# Vivado block design proj_blk_design, xcu25-ffvc1760-2LV-e, Vivado 2020.1_AR75245
# (continued, part 2 of 3)
current_bd_instance /from_MAC10_is_MAC1

# ---- hierarchy /from_MAC01_is_MAC2 ----
current_bd_instance /from_MAC01_is_MAC2
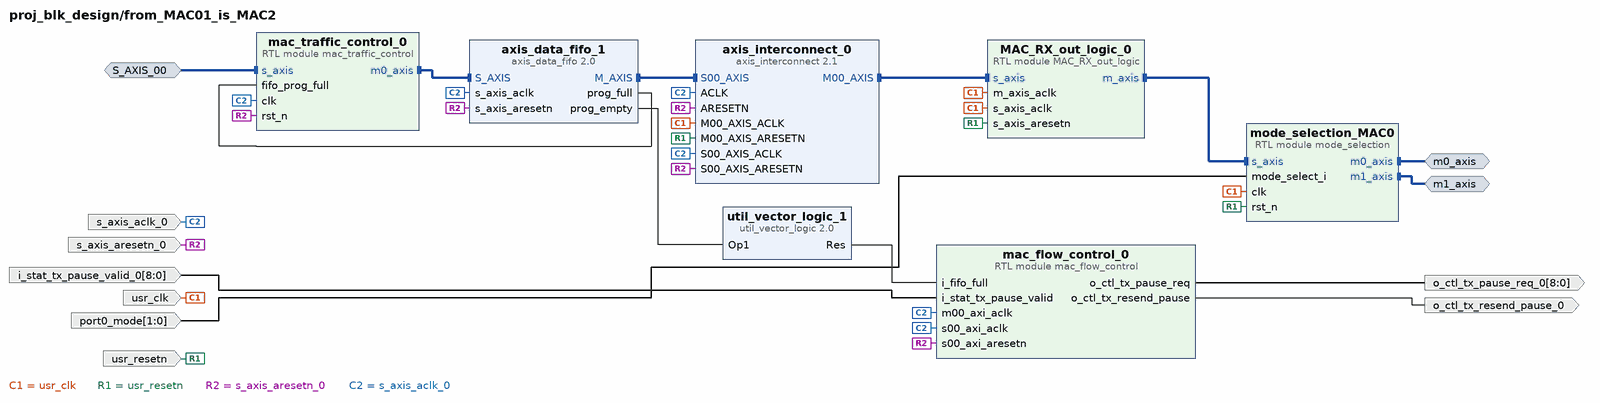
[diagram p10: block diagram inside /from_MAC01_is_MAC2]
create_bd_intf_pin -mode Slave -vlnv xilinx.com:interface:axis_rtl:1.0 S_AXIS_00
create_bd_intf_pin -mode Master -vlnv xilinx.com:interface:axis_rtl:1.0 m1_axis
create_bd_intf_pin -mode Master -vlnv xilinx.com:interface:axis_rtl:1.0 m0_axis
create_bd_pin -dir I -type clk usr_clk
create_bd_pin -dir I -type rst usr_resetn
create_bd_pin -dir I -from 8 -to 0 i_stat_tx_pause_valid_0
create_bd_pin -dir O -from 8 -to 0 o_ctl_tx_pause_req_0
create_bd_pin -dir O o_ctl_tx_resend_pause_0
create_bd_pin -dir I -type rst s_axis_aresetn_0
create_bd_pin -dir I -type clk s_axis_aclk_0
create_bd_pin -dir I -from 1 -to 0 port0_mode

create_bd_cell -type ip -vlnv xilinx.com:ip:axis_data_fifo:2.0 axis_data_fifo_1
set_property -dict [list \
  CONFIG.FIFO_DEPTH 1024 \
  CONFIG.FIFO_MODE 2 \
  CONFIG.HAS_PROG_EMPTY 1 \
  CONFIG.HAS_PROG_FULL 1 \
  CONFIG.HAS_TKEEP 1 \
  CONFIG.PROG_EMPTY_THRESH 300 \
  CONFIG.PROG_FULL_THRESH 800 \
  CONFIG.TDATA_NUM_BYTES 8 \
  CONFIG.TDEST_WIDTH 0 \
] [get_bd_cells axis_data_fifo_1]
create_bd_cell -type ip -vlnv xilinx.com:ip:util_vector_logic:2.0 util_vector_logic_1
set_property -dict {CONFIG.C_OPERATION not CONFIG.C_SIZE 1} [get_bd_cells util_vector_logic_1]
create_bd_cell -type ip -vlnv xilinx.com:ip:axis_interconnect:2.1 axis_interconnect_0
set_property -dict [list \
  CONFIG.ARB_ON_TLAST 1 \
  CONFIG.M00_AXIS_HIGHTDEST 0x00000003 \
  CONFIG.M00_FIFO_DEPTH 32 \
  CONFIG.M00_FIFO_MODE 0 \
  CONFIG.M00_HAS_REGSLICE 1 \
  CONFIG.NUM_MI 1 \
  CONFIG.S00_FIFO_DEPTH 256 \
  CONFIG.S00_FIFO_MODE 1 \
  CONFIG.S00_HAS_REGSLICE 1 \
] [get_bd_cells axis_interconnect_0]
create_bd_cell -type module -reference mac_traffic_control mac_traffic_control_0
create_bd_cell -type module -reference MAC_RX_out_logic MAC_RX_out_logic_0
set_property -dict {CONFIG.TDEST_VALUE {"10"}} [get_bd_cells MAC_RX_out_logic_0]
create_bd_cell -type module -reference mac_flow_control mac_flow_control_0
create_bd_cell -type module -reference mode_selection mode_selection_MAC0

# ---- hierarchy /from_MAC11_is_MAC3 ----
current_bd_instance /from_MAC11_is_MAC3
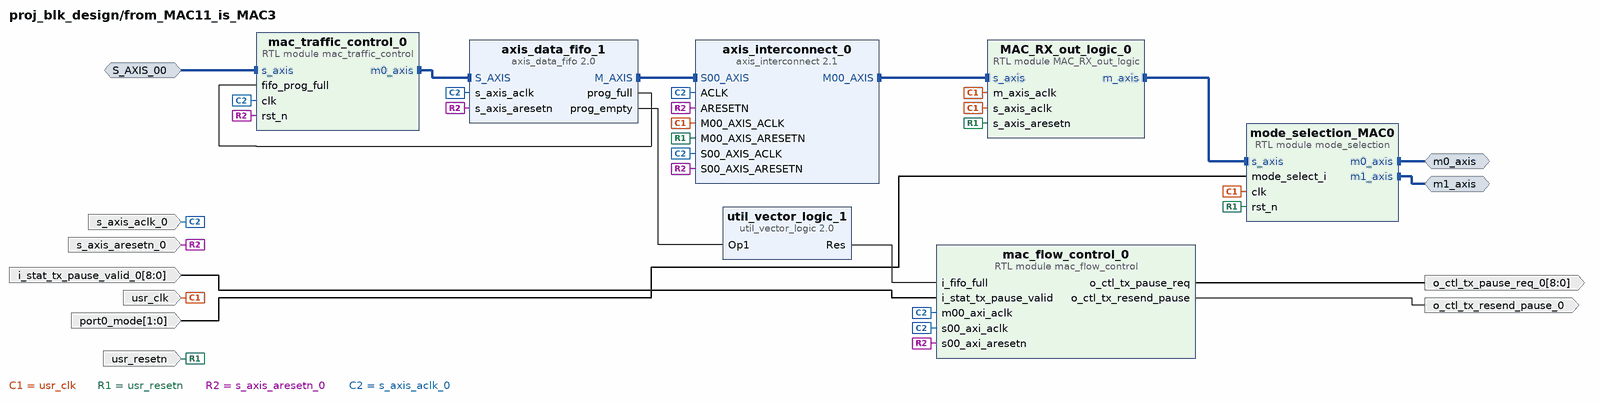
[diagram p11: block diagram inside /from_MAC11_is_MAC3]
create_bd_intf_pin -mode Slave -vlnv xilinx.com:interface:axis_rtl:1.0 S_AXIS_00
create_bd_intf_pin -mode Master -vlnv xilinx.com:interface:axis_rtl:1.0 m1_axis
create_bd_intf_pin -mode Master -vlnv xilinx.com:interface:axis_rtl:1.0 m0_axis
create_bd_pin -dir I -type clk usr_clk
create_bd_pin -dir I -type rst usr_resetn
create_bd_pin -dir I -from 8 -to 0 i_stat_tx_pause_valid_0
create_bd_pin -dir O -from 8 -to 0 o_ctl_tx_pause_req_0
create_bd_pin -dir O o_ctl_tx_resend_pause_0
create_bd_pin -dir I -type rst s_axis_aresetn_0
create_bd_pin -dir I -type clk s_axis_aclk_0
create_bd_pin -dir I -from 1 -to 0 port0_mode

create_bd_cell -type ip -vlnv xilinx.com:ip:axis_data_fifo:2.0 axis_data_fifo_1
set_property -dict [list \
  CONFIG.FIFO_DEPTH 1024 \
  CONFIG.FIFO_MODE 2 \
  CONFIG.HAS_PROG_EMPTY 1 \
  CONFIG.HAS_PROG_FULL 1 \
  CONFIG.HAS_TKEEP 1 \
  CONFIG.PROG_EMPTY_THRESH 300 \
  CONFIG.PROG_FULL_THRESH 800 \
  CONFIG.TDATA_NUM_BYTES 8 \
  CONFIG.TDEST_WIDTH 0 \
] [get_bd_cells axis_data_fifo_1]
create_bd_cell -type ip -vlnv xilinx.com:ip:util_vector_logic:2.0 util_vector_logic_1
set_property -dict {CONFIG.C_OPERATION not CONFIG.C_SIZE 1} [get_bd_cells util_vector_logic_1]
create_bd_cell -type ip -vlnv xilinx.com:ip:axis_interconnect:2.1 axis_interconnect_0
set_property -dict [list \
  CONFIG.ARB_ON_TLAST 1 \
  CONFIG.M00_AXIS_HIGHTDEST 0x00000003 \
  CONFIG.M00_FIFO_DEPTH 32 \
  CONFIG.M00_FIFO_MODE 0 \
  CONFIG.M00_HAS_REGSLICE 1 \
  CONFIG.NUM_MI 1 \
  CONFIG.S00_FIFO_DEPTH 256 \
  CONFIG.S00_FIFO_MODE 1 \
  CONFIG.S00_HAS_REGSLICE 1 \
] [get_bd_cells axis_interconnect_0]
create_bd_cell -type module -reference mac_traffic_control mac_traffic_control_0
create_bd_cell -type module -reference MAC_RX_out_logic MAC_RX_out_logic_0
set_property -dict {CONFIG.TDEST_VALUE {"11"}} [get_bd_cells MAC_RX_out_logic_0]
create_bd_cell -type module -reference mac_flow_control mac_flow_control_0
create_bd_cell -type module -reference mode_selection mode_selection_MAC0

# ---- connections ----

current_bd_instance /MCDI
connect_bd_intf_net [get_bd_intf_pins INTC_to_MCDI/M00_AXIS] [get_bd_intf_pins mcdi_check_0/s_axis]
connect_bd_intf_net [get_bd_intf_pins m1_axis] [get_bd_intf_pins demux_logic_MCDI_0/m1_axis]
connect_bd_intf_net [get_bd_intf_pins m0_axis_MCDI] [get_bd_intf_pins demux_logic_MCDI_0/m0_axis]
connect_bd_intf_net [get_bd_intf_pins S00_AXIS] [get_bd_intf_pins INTC_to_MCDI/S00_AXIS]
connect_bd_intf_net [get_bd_intf_pins S01_AXIS] [get_bd_intf_pins INTC_to_MCDI/S01_AXIS]
connect_bd_net -net aclk_1 [get_bd_pins clk_200M] \
  [get_bd_pins INTC_to_MCDI/ACLK] [get_bd_pins INTC_to_MCDI/M00_AXIS_ACLK] [get_bd_pins INTC_to_MCDI/S00_AXIS_ACLK] \
  [get_bd_pins INTC_to_MCDI/S01_AXIS_ACLK] [get_bd_pins axis_register_slice_0/aclk] \
  [get_bd_pins demux_logic_MCDI_0/m0_axis_aclk] [get_bd_pins demux_logic_MCDI_0/m1_axis_aclk] \
  [get_bd_pins demux_logic_MCDI_0/s_axis_aclk] [get_bd_pins mcdi_check_0/m_axis_aclk] [get_bd_pins mcdi_check_0/s_axis_aclk]
connect_bd_net [get_bd_pins axis_register_slice_0/m_axis_tdata] [get_bd_pins demux_logic_MCDI_0/s_axis_tdata]
connect_bd_net [get_bd_pins axis_register_slice_0/m_axis_tdest] [get_bd_pins demux_logic_MCDI_0/s_axis_tdest]
connect_bd_net [get_bd_pins axis_register_slice_0/m_axis_tkeep] [get_bd_pins demux_logic_MCDI_0/s_axis_tkeep]
connect_bd_net [get_bd_pins axis_register_slice_0/m_axis_tlast] [get_bd_pins demux_logic_MCDI_0/s_axis_tlast]
connect_bd_net [get_bd_pins axis_register_slice_0/m_axis_tuser] [get_bd_pins demux_logic_MCDI_0/demux_en]
connect_bd_net [get_bd_pins axis_register_slice_0/m_axis_tvalid] [get_bd_pins demux_logic_MCDI_0/s_axis_tvalid]
connect_bd_net [get_bd_pins axis_register_slice_0/s_axis_tready] [get_bd_pins mcdi_check_0/m_axis_tready]
connect_bd_net [get_bd_pins demux_logic_MCDI_0/s_axis_tready] [get_bd_pins axis_register_slice_0/m_axis_tready]
connect_bd_net [get_bd_pins mcdi_check_0/m_axis_tdata] [get_bd_pins axis_register_slice_0/s_axis_tdata]
connect_bd_net [get_bd_pins mcdi_check_0/m_axis_tdest] [get_bd_pins axis_register_slice_0/s_axis_tdest]
connect_bd_net [get_bd_pins mcdi_check_0/m_axis_tkeep] [get_bd_pins axis_register_slice_0/s_axis_tkeep]
connect_bd_net [get_bd_pins mcdi_check_0/m_axis_tlast] [get_bd_pins axis_register_slice_0/s_axis_tlast]
connect_bd_net [get_bd_pins mcdi_check_0/m_axis_tvalid] [get_bd_pins axis_register_slice_0/s_axis_tvalid]
connect_bd_net [get_bd_pins mcdi_check_0/mcdi_flag_o] [get_bd_pins axis_register_slice_0/s_axis_tuser]
connect_bd_net [get_bd_pins port0_mode] [get_bd_pins mcdi_check_0/mode_select_MAC2]
connect_bd_net [get_bd_pins port1_mode] [get_bd_pins mcdi_check_0/mode_select_MAC3]
connect_bd_net [get_bd_pins s_axi_aresetn] \
  [get_bd_pins INTC_to_MCDI/ARESETN] [get_bd_pins INTC_to_MCDI/M00_AXIS_ARESETN] [get_bd_pins INTC_to_MCDI/S00_AXIS_ARESETN] \
  [get_bd_pins INTC_to_MCDI/S01_AXIS_ARESETN] [get_bd_pins axis_register_slice_0/aresetn] \
  [get_bd_pins demux_logic_MCDI_0/s_axis_aresetn] [get_bd_pins mcdi_check_0/s_axis_aresetn]

current_bd_instance /PS
connect_bd_intf_net [get_bd_intf_pins S_AXIS] [get_bd_intf_pins axis_data_fifo_0/S_AXIS]
connect_bd_intf_net [get_bd_intf_pins axi_mcdma_0/M_AXI_MM2S] [get_bd_intf_pins smartconnect_0/S00_AXI]
connect_bd_intf_net [get_bd_intf_pins M_AXIS_MM2S] [get_bd_intf_pins axi_mcdma_0/M_AXIS_MM2S]
connect_bd_intf_net [get_bd_intf_pins S_AXI_LITE] [get_bd_intf_pins axi_mcdma_0/S_AXI_LITE]
connect_bd_intf_net [get_bd_intf_pins M_AXI_HPM0_LPD] [get_bd_intf_pins zynq_ultra_ps_e_0/M_AXI_HPM0_LPD]
connect_bd_intf_net [get_bd_intf_pins axi_mcdma_0/M_AXI_SG] [get_bd_intf_pins smartconnect_0/S02_AXI]
connect_bd_intf_net [get_bd_intf_pins axis_data_fifo_0/M_AXIS] [get_bd_intf_pins axi_mcdma_0/S_AXIS_S2MM]
connect_bd_intf_net [get_bd_intf_pins axi_mcdma_0/M_AXI_S2MM] [get_bd_intf_pins smartconnect_0/S01_AXI]
connect_bd_intf_net [get_bd_intf_pins smartconnect_0/M00_AXI] [get_bd_intf_pins zynq_ultra_ps_e_0/S_AXI_HP0_FPD]
connect_bd_net [get_bd_pins axi_mcdma_0/mm2s_ch1_introut] [get_bd_pins xlconcat_0/In0]
connect_bd_net [get_bd_pins axi_mcdma_0/mm2s_ch2_introut] [get_bd_pins xlconcat_0/In1]
connect_bd_net [get_bd_pins axi_mcdma_0/mm2s_ch3_introut] [get_bd_pins xlconcat_0/In2]
connect_bd_net [get_bd_pins axi_mcdma_0/mm2s_ch4_introut] [get_bd_pins xlconcat_0/In3]
connect_bd_net [get_bd_pins axi_mcdma_0/s2mm_ch1_introut] [get_bd_pins xlconcat_1/In0]
connect_bd_net [get_bd_pins axi_mcdma_0/s2mm_ch2_introut] [get_bd_pins xlconcat_1/In1]
connect_bd_net [get_bd_pins axi_mcdma_0/s2mm_ch3_introut] [get_bd_pins xlconcat_1/In2]
connect_bd_net [get_bd_pins axi_mcdma_0/s2mm_ch4_introut] [get_bd_pins xlconcat_1/In3]
connect_bd_net [get_bd_pins util_reduced_logic_0/Res] [get_bd_pins xlconcat_2/In0]
connect_bd_net [get_bd_pins util_reduced_logic_1/Res] [get_bd_pins xlconcat_2/In1]
connect_bd_net [get_bd_pins xlconcat_0/dout] [get_bd_pins util_reduced_logic_1/Op1]
connect_bd_net [get_bd_pins xlconcat_1/dout] [get_bd_pins util_reduced_logic_0/Op1]
connect_bd_net [get_bd_pins xlconcat_2/dout] [get_bd_pins zynq_ultra_ps_e_0/pl_ps_irq0]
connect_bd_net [get_bd_pins zynq_ultra_ps_e_0/pl_clk0] \
  [get_bd_pins pl_clk0] [get_bd_pins axi_mcdma_0/m_axi_mm2s_aclk] [get_bd_pins axi_mcdma_0/m_axi_s2mm_aclk] \
  [get_bd_pins axi_mcdma_0/m_axi_sg_aclk] [get_bd_pins axi_mcdma_0/s_axi_lite_aclk] \
  [get_bd_pins proc_sys_reset_0/slowest_sync_clk] [get_bd_pins smartconnect_0/aclk] \
  [get_bd_pins zynq_ultra_ps_e_0/maxihpm0_lpd_aclk] [get_bd_pins zynq_ultra_ps_e_0/saxihp0_fpd_aclk] \
  [get_bd_pins axis_data_fifo_0/m_axis_aclk]
connect_bd_net -net zynq_ultra_ps_e_0_pl_resetn0 [get_bd_pins proc_sys_reset_0/peripheral_aresetn] \
  [get_bd_pins peripheral_aresetn] [get_bd_pins axi_mcdma_0/axi_resetn] [get_bd_pins smartconnect_0/aresetn]
connect_bd_net [get_bd_pins zynq_ultra_ps_e_0/pl_resetn0] [get_bd_pins proc_sys_reset_0/ext_reset_in]
connect_bd_net [get_bd_pins S00_AXIS_ACLK] [get_bd_pins axis_data_fifo_0/s_axis_aclk]
connect_bd_net -net s_axis_aresetn_0_1 [get_bd_pins s_axis_aresetn_0] [get_bd_pins axis_data_fifo_0/s_axis_aresetn]

current_bd_instance /from_MAC00_is_MAC0
connect_bd_intf_net [get_bd_intf_pins mac_traffic_control_0/m0_axis] [get_bd_intf_pins axis_data_fifo_1/S_AXIS]
connect_bd_intf_net [get_bd_intf_pins axis_data_fifo_1/M_AXIS] [get_bd_intf_pins axis_interconnect_0/S00_AXIS]
connect_bd_intf_net [get_bd_intf_pins S_AXIS_00] [get_bd_intf_pins mac_traffic_control_0/s_axis]
connect_bd_intf_net [get_bd_intf_pins m1_axis] [get_bd_intf_pins mode_selection_MAC0/m1_axis]
connect_bd_intf_net [get_bd_intf_pins MAC_RX_out_logic_0/m_axis] [get_bd_intf_pins mode_selection_MAC0/s_axis]
connect_bd_intf_net [get_bd_intf_pins m0_axis] [get_bd_intf_pins mode_selection_MAC0/m0_axis]
connect_bd_intf_net [get_bd_intf_pins axis_interconnect_0/M00_AXIS] [get_bd_intf_pins MAC_RX_out_logic_0/s_axis]
connect_bd_net [get_bd_pins util_vector_logic_1/Res] [get_bd_pins mac_flow_control_0/i_fifo_full]
connect_bd_net [get_bd_pins axis_data_fifo_1/prog_full] [get_bd_pins mac_traffic_control_0/fifo_prog_full]
connect_bd_net [get_bd_pins axis_data_fifo_1/prog_empty] [get_bd_pins util_vector_logic_1/Op1]
connect_bd_net [get_bd_pins usr_clk] \
  [get_bd_pins axis_interconnect_0/M00_AXIS_ACLK] [get_bd_pins MAC_RX_out_logic_0/s_axis_aclk] \
  [get_bd_pins MAC_RX_out_logic_0/m_axis_aclk] [get_bd_pins mode_selection_MAC0/clk]
connect_bd_net [get_bd_pins usr_resetn] \
  [get_bd_pins axis_interconnect_0/M00_AXIS_ARESETN] [get_bd_pins MAC_RX_out_logic_0/s_axis_aresetn] \
  [get_bd_pins mode_selection_MAC0/rst_n]
connect_bd_net -net i_stat_tx_pause_valid_0_1 [get_bd_pins i_stat_tx_pause_valid_0] [get_bd_pins mac_flow_control_0/i_stat_tx_pause_valid]
connect_bd_net [get_bd_pins mac_flow_control_0/o_ctl_tx_pause_req] [get_bd_pins o_ctl_tx_pause_req_0]
connect_bd_net [get_bd_pins mac_flow_control_0/o_ctl_tx_resend_pause] [get_bd_pins o_ctl_tx_resend_pause_0]
connect_bd_net -net s_axis_aresetn_0_1 [get_bd_pins s_axis_aresetn_0] \
  [get_bd_pins axis_data_fifo_1/s_axis_aresetn] [get_bd_pins axis_interconnect_0/ARESETN] \
  [get_bd_pins axis_interconnect_0/S00_AXIS_ARESETN] [get_bd_pins mac_traffic_control_0/rst_n] \
  [get_bd_pins mac_flow_control_0/s00_axi_aresetn]
connect_bd_net -net s_axis_aclk_0_1 [get_bd_pins s_axis_aclk_0] \
  [get_bd_pins axis_interconnect_0/S00_AXIS_ACLK] [get_bd_pins axis_interconnect_0/ACLK] \
  [get_bd_pins axis_data_fifo_1/s_axis_aclk] [get_bd_pins mac_traffic_control_0/clk] \
  [get_bd_pins mac_flow_control_0/s00_axi_aclk] [get_bd_pins mac_flow_control_0/m00_axi_aclk]
connect_bd_net [get_bd_pins port0_mode] [get_bd_pins mode_selection_MAC0/mode_select_i]

current_bd_instance /from_ps
connect_bd_intf_net [get_bd_intf_pins Control_VLAN_PUSH_0/m_axis] [get_bd_intf_pins demux_logic_0/s_axis]
connect_bd_intf_net [get_bd_intf_pins S_AXIS] [get_bd_intf_pins fifo_PS_to_Cntrl_VLAN/S_AXIS]
connect_bd_intf_net [get_bd_intf_pins M_AXIS1] [get_bd_intf_pins fifo_CNTRL_VLAN_to_MAC2/M_AXIS]
connect_bd_intf_net [get_bd_intf_pins M_AXIS] [get_bd_intf_pins fifo_CNTRL_VLAN_to_MAC3/M_AXIS]
connect_bd_net [get_bd_pins Control_VLAN_PUSH_0/egress_flag] [get_bd_pins demux_logic_0/demux_en]
connect_bd_net [get_bd_pins demux_logic_0/m0_axis_tvalid] [get_bd_pins fifo_CNTRL_VLAN_to_MAC2/s_axis_tvalid]
connect_bd_net [get_bd_pins fifo_CNTRL_VLAN_to_MAC2/s_axis_tready] [get_bd_pins demux_logic_0/m0_axis_tready]
connect_bd_net [get_bd_pins demux_logic_0/m0_axis_tlast] [get_bd_pins fifo_CNTRL_VLAN_to_MAC2/s_axis_tlast]
connect_bd_net [get_bd_pins demux_logic_0/m0_axis_tdata] [get_bd_pins fifo_CNTRL_VLAN_to_MAC2/s_axis_tdata]
connect_bd_net [get_bd_pins demux_logic_0/m0_axis_tkeep] [get_bd_pins fifo_CNTRL_VLAN_to_MAC2/s_axis_tkeep]
connect_bd_net [get_bd_pins demux_logic_0/m1_axis_tvalid] [get_bd_pins fifo_CNTRL_VLAN_to_MAC3/s_axis_tvalid]
connect_bd_net [get_bd_pins fifo_CNTRL_VLAN_to_MAC3/s_axis_tready] [get_bd_pins demux_logic_0/m1_axis_tready]
connect_bd_net [get_bd_pins demux_logic_0/m1_axis_tlast] [get_bd_pins fifo_CNTRL_VLAN_to_MAC3/s_axis_tlast]
connect_bd_net [get_bd_pins demux_logic_0/m1_axis_tdata] [get_bd_pins fifo_CNTRL_VLAN_to_MAC3/s_axis_tdata]
connect_bd_net [get_bd_pins demux_logic_0/m1_axis_tkeep] [get_bd_pins fifo_CNTRL_VLAN_to_MAC3/s_axis_tkeep]
connect_bd_net [get_bd_pins fifo_PS_to_Cntrl_VLAN/m_axis_tvalid] [get_bd_pins Control_VLAN_PUSH_0/s_axis_tvalid]
connect_bd_net [get_bd_pins Control_VLAN_PUSH_0/s_axis_tready] [get_bd_pins fifo_PS_to_Cntrl_VLAN/m_axis_tready]
connect_bd_net [get_bd_pins fifo_PS_to_Cntrl_VLAN/m_axis_tdata] [get_bd_pins Control_VLAN_PUSH_0/s_axis_tdata]
connect_bd_net [get_bd_pins fifo_PS_to_Cntrl_VLAN/m_axis_tkeep] [get_bd_pins Control_VLAN_PUSH_0/s_axis_tkeep]
connect_bd_net [get_bd_pins fifo_PS_to_Cntrl_VLAN/m_axis_tlast] [get_bd_pins Control_VLAN_PUSH_0/s_axis_tlast]
connect_bd_net [get_bd_pins fifo_PS_to_Cntrl_VLAN/m_axis_tdest] [get_bd_pins Control_VLAN_PUSH_0/s_axis_tdest]
connect_bd_net -net clk_wiz_0_clk_out2 [get_bd_pins m1_axis_aclk] \
  [get_bd_pins demux_logic_0/m1_axis_aclk] [get_bd_pins demux_logic_0/m0_axis_aclk] \
  [get_bd_pins Control_VLAN_PUSH_0/m_axis_aclk] [get_bd_pins Control_VLAN_PUSH_0/s_axis_aclk] \
  [get_bd_pins fifo_CNTRL_VLAN_to_MAC3/s_axis_aclk] [get_bd_pins fifo_CNTRL_VLAN_to_MAC2/s_axis_aclk] \
  [get_bd_pins fifo_PS_to_Cntrl_VLAN/m_axis_aclk] [get_bd_pins demux_logic_0/s_axis_aclk]
connect_bd_net -net clk_wiz_0_locked1 [get_bd_pins s_axis_aresetn] \
  [get_bd_pins fifo_PS_to_Cntrl_VLAN/s_axis_aresetn] [get_bd_pins Control_VLAN_PUSH_0/s_axis_aresetn] \
  [get_bd_pins fifo_CNTRL_VLAN_to_MAC3/s_axis_aresetn] [get_bd_pins fifo_CNTRL_VLAN_to_MAC2/s_axis_aresetn] \
  [get_bd_pins demux_logic_0/s_axis_aresetn]
connect_bd_net -net qdma_axi_aclk [get_bd_pins s_axis_aclk] [get_bd_pins fifo_PS_to_Cntrl_VLAN/s_axis_aclk]

current_bd_instance /to_MAC00_is_MAC0
connect_bd_intf_net [get_bd_intf_pins axis_interconnect_0/M00_AXIS] [get_bd_intf_pins tx_flow_control_0/s_axis]
connect_bd_intf_net [get_bd_intf_pins S00_AXIS] [get_bd_intf_pins axis_interconnect_0/S00_AXIS]
connect_bd_intf_net [get_bd_intf_pins m_axis_01] [get_bd_intf_pins tx_flow_control_0/m_axis]
connect_bd_intf_net [get_bd_intf_pins S01_AXIS] [get_bd_intf_pins axis_interconnect_0/S01_AXIS]
connect_bd_net [get_bd_pins util_vector_logic_1/Res] [get_bd_pins tx_flow_control_0/tready_frm_flow_cntrl]
connect_bd_net [get_bd_pins xlslice_0/Dout] [get_bd_pins util_vector_logic_1/Op1]
connect_bd_net -net M00_AXIS_ARESETN_0_1 [get_bd_pins s_axis_aresetn] \
  [get_bd_pins axis_interconnect_0/M00_AXIS_ARESETN] [get_bd_pins tx_flow_control_0/s_axis_aresetn]
connect_bd_net -net M00_AXIS_ACLK_0_1 [get_bd_pins tx_clk_01] \
  [get_bd_pins axis_interconnect_0/M00_AXIS_ACLK] [get_bd_pins tx_flow_control_0/m_axis_aclk] \
  [get_bd_pins tx_flow_control_0/s_axis_aclk]
connect_bd_net -net Din_0_1 [get_bd_pins stat_rx_pause_req_01_i] [get_bd_pins xlslice_0/Din]
connect_bd_net [get_bd_pins usr_clk] \
  [get_bd_pins axis_interconnect_0/S00_AXIS_ACLK] [get_bd_pins axis_interconnect_0/ACLK] \
  [get_bd_pins axis_interconnect_0/S01_AXIS_ACLK]
connect_bd_net [get_bd_pins user_aresetn] \
  [get_bd_pins axis_interconnect_0/S00_AXIS_ARESETN] [get_bd_pins axis_interconnect_0/ARESETN] \
  [get_bd_pins axis_interconnect_0/S01_AXIS_ARESETN]

current_bd_instance /to_MAC01_is_MAC2
connect_bd_intf_net [get_bd_intf_pins axis_interconnect_0/M00_AXIS] [get_bd_intf_pins tx_flow_control_0/s_axis]
connect_bd_intf_net [get_bd_intf_pins S01_AXIS] [get_bd_intf_pins axis_interconnect_0/S01_AXIS]
connect_bd_intf_net [get_bd_intf_pins S02_AXIS] [get_bd_intf_pins axis_interconnect_0/S02_AXIS]
connect_bd_intf_net [get_bd_intf_pins S00_AXIS] [get_bd_intf_pins axis_interconnect_0/S00_AXIS]
connect_bd_intf_net [get_bd_intf_pins m_axis_01] [get_bd_intf_pins tx_flow_control_0/m_axis]
connect_bd_net [get_bd_pins util_vector_logic_1/Res] [get_bd_pins tx_flow_control_0/tready_frm_flow_cntrl]
connect_bd_net [get_bd_pins xlslice_0/Dout] [get_bd_pins util_vector_logic_1/Op1]
connect_bd_net -net M00_AXIS_ARESETN_0_1 [get_bd_pins s_axis_aresetn] \
  [get_bd_pins axis_interconnect_0/M00_AXIS_ARESETN] [get_bd_pins tx_flow_control_0/s_axis_aresetn]
connect_bd_net -net M00_AXIS_ACLK_0_1 [get_bd_pins tx_clk_01] \
  [get_bd_pins axis_interconnect_0/M00_AXIS_ACLK] [get_bd_pins tx_flow_control_0/m_axis_aclk] \
  [get_bd_pins tx_flow_control_0/s_axis_aclk]
connect_bd_net -net Din_0_1 [get_bd_pins stat_rx_pause_req_01_i] [get_bd_pins xlslice_0/Din]
connect_bd_net [get_bd_pins usr_clk] \
  [get_bd_pins axis_interconnect_0/S00_AXIS_ACLK] [get_bd_pins axis_interconnect_0/ACLK] \
  [get_bd_pins axis_interconnect_0/S01_AXIS_ACLK] [get_bd_pins axis_interconnect_0/S02_AXIS_ACLK]
connect_bd_net [get_bd_pins user_aresetn] \
  [get_bd_pins axis_interconnect_0/S00_AXIS_ARESETN] [get_bd_pins axis_interconnect_0/ARESETN] \
  [get_bd_pins axis_interconnect_0/S01_AXIS_ARESETN] [get_bd_pins axis_interconnect_0/S02_AXIS_ARESETN]

current_bd_instance /to_MAC11_is_MAC3
connect_bd_intf_net [get_bd_intf_pins axis_interconnect_0/M00_AXIS] [get_bd_intf_pins tx_flow_control_0/s_axis]
connect_bd_intf_net [get_bd_intf_pins S01_AXIS] [get_bd_intf_pins axis_interconnect_0/S01_AXIS]
connect_bd_intf_net [get_bd_intf_pins m_axis_01] [get_bd_intf_pins tx_flow_control_0/m_axis]
connect_bd_intf_net [get_bd_intf_pins S00_AXIS] [get_bd_intf_pins axis_interconnect_0/S00_AXIS]
connect_bd_intf_net [get_bd_intf_pins S02_AXIS] [get_bd_intf_pins axis_interconnect_0/S02_AXIS]
connect_bd_net [get_bd_pins util_vector_logic_1/Res] [get_bd_pins tx_flow_control_0/tready_frm_flow_cntrl]
connect_bd_net [get_bd_pins xlslice_0/Dout] [get_bd_pins util_vector_logic_1/Op1]
connect_bd_net -net M00_AXIS_ARESETN_0_1 [get_bd_pins s_axis_aresetn] \
  [get_bd_pins axis_interconnect_0/M00_AXIS_ARESETN] [get_bd_pins tx_flow_control_0/s_axis_aresetn]
connect_bd_net -net M00_AXIS_ACLK_0_1 [get_bd_pins tx_clk_11] \
  [get_bd_pins axis_interconnect_0/M00_AXIS_ACLK] [get_bd_pins tx_flow_control_0/m_axis_aclk] \
  [get_bd_pins tx_flow_control_0/s_axis_aclk]
connect_bd_net -net Din_0_1 [get_bd_pins stat_rx_pause_req_11_i] [get_bd_pins xlslice_0/Din]
connect_bd_net [get_bd_pins usr_clk] \
  [get_bd_pins axis_interconnect_0/S00_AXIS_ACLK] [get_bd_pins axis_interconnect_0/ACLK] \
  [get_bd_pins axis_interconnect_0/S01_AXIS_ACLK] [get_bd_pins axis_interconnect_0/S02_AXIS_ACLK]
connect_bd_net [get_bd_pins user_aresetn] \
  [get_bd_pins axis_interconnect_0/S00_AXIS_ARESETN] [get_bd_pins axis_interconnect_0/ARESETN] \
  [get_bd_pins axis_interconnect_0/S01_AXIS_ARESETN] [get_bd_pins axis_interconnect_0/S02_AXIS_ARESETN]

current_bd_instance /to_MAC10_is_MAC1
connect_bd_intf_net [get_bd_intf_pins S00_AXIS] [get_bd_intf_pins axis_interconnect_0/S00_AXIS]
connect_bd_intf_net [get_bd_intf_pins axis_interconnect_0/M00_AXIS] [get_bd_intf_pins tx_flow_control_0/s_axis]
connect_bd_intf_net [get_bd_intf_pins m_axis_01] [get_bd_intf_pins tx_flow_control_0/m_axis]
connect_bd_intf_net [get_bd_intf_pins S01_AXIS] [get_bd_intf_pins axis_interconnect_0/S01_AXIS]
connect_bd_net [get_bd_pins util_vector_logic_1/Res] [get_bd_pins tx_flow_control_0/tready_frm_flow_cntrl]
connect_bd_net [get_bd_pins xlslice_0/Dout] [get_bd_pins util_vector_logic_1/Op1]
connect_bd_net -net M00_AXIS_ARESETN_0_1 [get_bd_pins s_axis_aresetn] \
  [get_bd_pins axis_interconnect_0/M00_AXIS_ARESETN] [get_bd_pins tx_flow_control_0/s_axis_aresetn]
connect_bd_net -net M00_AXIS_ACLK_0_1 [get_bd_pins tx_clk_01] \
  [get_bd_pins axis_interconnect_0/M00_AXIS_ACLK] [get_bd_pins tx_flow_control_0/m_axis_aclk] \
  [get_bd_pins tx_flow_control_0/s_axis_aclk]
connect_bd_net -net Din_0_1 [get_bd_pins stat_rx_pause_req_01_i] [get_bd_pins xlslice_0/Din]
connect_bd_net [get_bd_pins usr_clk] \
  [get_bd_pins axis_interconnect_0/S00_AXIS_ACLK] [get_bd_pins axis_interconnect_0/ACLK] \
  [get_bd_pins axis_interconnect_0/S01_AXIS_ACLK]
connect_bd_net [get_bd_pins user_aresetn] \
  [get_bd_pins axis_interconnect_0/S00_AXIS_ARESETN] [get_bd_pins axis_interconnect_0/ARESETN] \
  [get_bd_pins axis_interconnect_0/S01_AXIS_ARESETN]

current_bd_instance /from_MAC10_is_MAC1
connect_bd_intf_net [get_bd_intf_pins m0_axis] [get_bd_intf_pins mode_selection_MAC0/m0_axis]
connect_bd_intf_net [get_bd_intf_pins S_AXIS_00] [get_bd_intf_pins mac_traffic_control_0/s_axis]
connect_bd_intf_net [get_bd_intf_pins mac_traffic_control_0/m0_axis] [get_bd_intf_pins axis_data_fifo_1/S_AXIS]
connect_bd_intf_net [get_bd_intf_pins axis_data_fifo_1/M_AXIS] [get_bd_intf_pins axis_interconnect_0/S00_AXIS]
connect_bd_intf_net [get_bd_intf_pins m1_axis] [get_bd_intf_pins mode_selection_MAC0/m1_axis]
connect_bd_intf_net [get_bd_intf_pins MAC_RX_out_logic_0/m_axis] [get_bd_intf_pins mode_selection_MAC0/s_axis]
connect_bd_intf_net [get_bd_intf_pins axis_interconnect_0/M00_AXIS] [get_bd_intf_pins MAC_RX_out_logic_0/s_axis]
connect_bd_net [get_bd_pins util_vector_logic_1/Res] [get_bd_pins mac_flow_control_0/i_fifo_full]
connect_bd_net [get_bd_pins axis_data_fifo_1/prog_full] [get_bd_pins mac_traffic_control_0/fifo_prog_full]
connect_bd_net [get_bd_pins axis_data_fifo_1/prog_empty] [get_bd_pins util_vector_logic_1/Op1]
connect_bd_net [get_bd_pins usr_clk] \
  [get_bd_pins axis_interconnect_0/M00_AXIS_ACLK] [get_bd_pins MAC_RX_out_logic_0/s_axis_aclk] \
  [get_bd_pins MAC_RX_out_logic_0/m_axis_aclk] [get_bd_pins mode_selection_MAC0/clk]
connect_bd_net [get_bd_pins usr_resetn] \
  [get_bd_pins axis_interconnect_0/M00_AXIS_ARESETN] [get_bd_pins MAC_RX_out_logic_0/s_axis_aresetn] \
  [get_bd_pins mode_selection_MAC0/rst_n]
connect_bd_net -net i_stat_tx_pause_valid_0_1 [get_bd_pins i_stat_tx_pause_valid_0] [get_bd_pins mac_flow_control_0/i_stat_tx_pause_valid]
connect_bd_net [get_bd_pins mac_flow_control_0/o_ctl_tx_pause_req] [get_bd_pins o_ctl_tx_pause_req_0]
connect_bd_net [get_bd_pins mac_flow_control_0/o_ctl_tx_resend_pause] [get_bd_pins o_ctl_tx_resend_pause_0]
connect_bd_net -net s_axis_aresetn_0_1 [get_bd_pins s_axis_aresetn_0] \
  [get_bd_pins axis_data_fifo_1/s_axis_aresetn] [get_bd_pins axis_interconnect_0/ARESETN] \
  [get_bd_pins axis_interconnect_0/S00_AXIS_ARESETN] [get_bd_pins mac_traffic_control_0/rst_n] \
  [get_bd_pins mac_flow_control_0/s00_axi_aresetn]
connect_bd_net -net s_axis_aclk_0_1 [get_bd_pins s_axis_aclk_0] \
  [get_bd_pins axis_interconnect_0/S00_AXIS_ACLK] [get_bd_pins axis_interconnect_0/ACLK] \
  [get_bd_pins axis_data_fifo_1/s_axis_aclk] [get_bd_pins mac_traffic_control_0/clk] \
  [get_bd_pins mac_flow_control_0/s00_axi_aclk] [get_bd_pins mac_flow_control_0/m00_axi_aclk]
connect_bd_net [get_bd_pins port0_mode] [get_bd_pins mode_selection_MAC0/mode_select_i]

current_bd_instance /from_MAC01_is_MAC2
connect_bd_intf_net [get_bd_intf_pins m1_axis] [get_bd_intf_pins mode_selection_MAC0/m1_axis]
connect_bd_intf_net [get_bd_intf_pins axis_interconnect_0/M00_AXIS] [get_bd_intf_pins MAC_RX_out_logic_0/s_axis]
connect_bd_intf_net [get_bd_intf_pins MAC_RX_out_logic_0/m_axis] [get_bd_intf_pins mode_selection_MAC0/s_axis]
connect_bd_intf_net [get_bd_intf_pins m0_axis] [get_bd_intf_pins mode_selection_MAC0/m0_axis]
connect_bd_intf_net [get_bd_intf_pins S_AXIS_00] [get_bd_intf_pins mac_traffic_control_0/s_axis]
connect_bd_intf_net [get_bd_intf_pins axis_data_fifo_1/M_AXIS] [get_bd_intf_pins axis_interconnect_0/S00_AXIS]
connect_bd_intf_net [get_bd_intf_pins mac_traffic_control_0/m0_axis] [get_bd_intf_pins axis_data_fifo_1/S_AXIS]
connect_bd_net [get_bd_pins util_vector_logic_1/Res] [get_bd_pins mac_flow_control_0/i_fifo_full]
connect_bd_net [get_bd_pins axis_data_fifo_1/prog_full] [get_bd_pins mac_traffic_control_0/fifo_prog_full]
connect_bd_net [get_bd_pins axis_data_fifo_1/prog_empty] [get_bd_pins util_vector_logic_1/Op1]
connect_bd_net [get_bd_pins usr_clk] \
  [get_bd_pins axis_interconnect_0/M00_AXIS_ACLK] [get_bd_pins MAC_RX_out_logic_0/s_axis_aclk] \
  [get_bd_pins MAC_RX_out_logic_0/m_axis_aclk] [get_bd_pins mode_selection_MAC0/clk]
connect_bd_net [get_bd_pins usr_resetn] \
  [get_bd_pins axis_interconnect_0/M00_AXIS_ARESETN] [get_bd_pins MAC_RX_out_logic_0/s_axis_aresetn] \
  [get_bd_pins mode_selection_MAC0/rst_n]
connect_bd_net -net i_stat_tx_pause_valid_0_1 [get_bd_pins i_stat_tx_pause_valid_0] [get_bd_pins mac_flow_control_0/i_stat_tx_pause_valid]
connect_bd_net [get_bd_pins mac_flow_control_0/o_ctl_tx_pause_req] [get_bd_pins o_ctl_tx_pause_req_0]
connect_bd_net [get_bd_pins mac_flow_control_0/o_ctl_tx_resend_pause] [get_bd_pins o_ctl_tx_resend_pause_0]
connect_bd_net -net s_axis_aresetn_0_1 [get_bd_pins s_axis_aresetn_0] \
  [get_bd_pins axis_data_fifo_1/s_axis_aresetn] [get_bd_pins axis_interconnect_0/ARESETN] \
  [get_bd_pins axis_interconnect_0/S00_AXIS_ARESETN] [get_bd_pins mac_traffic_control_0/rst_n] \
  [get_bd_pins mac_flow_control_0/s00_axi_aresetn]
connect_bd_net -net s_axis_aclk_0_1 [get_bd_pins s_axis_aclk_0] \
  [get_bd_pins axis_interconnect_0/S00_AXIS_ACLK] [get_bd_pins axis_interconnect_0/ACLK] \
  [get_bd_pins axis_data_fifo_1/s_axis_aclk] [get_bd_pins mac_traffic_control_0/clk] \
  [get_bd_pins mac_flow_control_0/s00_axi_aclk] [get_bd_pins mac_flow_control_0/m00_axi_aclk]
connect_bd_net [get_bd_pins port0_mode] [get_bd_pins mode_selection_MAC0/mode_select_i]

current_bd_instance /from_MAC11_is_MAC3
connect_bd_intf_net [get_bd_intf_pins axis_data_fifo_1/M_AXIS] [get_bd_intf_pins axis_interconnect_0/S00_AXIS]
connect_bd_intf_net [get_bd_intf_pins mac_traffic_control_0/m0_axis] [get_bd_intf_pins axis_data_fifo_1/S_AXIS]
connect_bd_intf_net [get_bd_intf_pins MAC_RX_out_logic_0/m_axis] [get_bd_intf_pins mode_selection_MAC0/s_axis]
connect_bd_intf_net [get_bd_intf_pins axis_interconnect_0/M00_AXIS] [get_bd_intf_pins MAC_RX_out_logic_0/s_axis]
connect_bd_intf_net [get_bd_intf_pins m1_axis] [get_bd_intf_pins mode_selection_MAC0/m1_axis]
connect_bd_intf_net [get_bd_intf_pins m0_axis] [get_bd_intf_pins mode_selection_MAC0/m0_axis]
connect_bd_intf_net [get_bd_intf_pins S_AXIS_00] [get_bd_intf_pins mac_traffic_control_0/s_axis]
connect_bd_net [get_bd_pins util_vector_logic_1/Res] [get_bd_pins mac_flow_control_0/i_fifo_full]
connect_bd_net [get_bd_pins axis_data_fifo_1/prog_full] [get_bd_pins mac_traffic_control_0/fifo_prog_full]
connect_bd_net [get_bd_pins axis_data_fifo_1/prog_empty] [get_bd_pins util_vector_logic_1/Op1]
connect_bd_net [get_bd_pins usr_clk] \
  [get_bd_pins axis_interconnect_0/M00_AXIS_ACLK] [get_bd_pins MAC_RX_out_logic_0/s_axis_aclk] \
  [get_bd_pins MAC_RX_out_logic_0/m_axis_aclk] [get_bd_pins mode_selection_MAC0/clk]
connect_bd_net [get_bd_pins usr_resetn] \
  [get_bd_pins axis_interconnect_0/M00_AXIS_ARESETN] [get_bd_pins MAC_RX_out_logic_0/s_axis_aresetn] \
  [get_bd_pins mode_selection_MAC0/rst_n]
connect_bd_net -net i_stat_tx_pause_valid_0_1 [get_bd_pins i_stat_tx_pause_valid_0] [get_bd_pins mac_flow_control_0/i_stat_tx_pause_valid]
connect_bd_net [get_bd_pins mac_flow_control_0/o_ctl_tx_pause_req] [get_bd_pins o_ctl_tx_pause_req_0]
connect_bd_net [get_bd_pins mac_flow_control_0/o_ctl_tx_resend_pause] [get_bd_pins o_ctl_tx_resend_pause_0]
connect_bd_net -net s_axis_aresetn_0_1 [get_bd_pins s_axis_aresetn_0] \
  [get_bd_pins axis_data_fifo_1/s_axis_aresetn] [get_bd_pins axis_interconnect_0/ARESETN] \
  [get_bd_pins axis_interconnect_0/S00_AXIS_ARESETN] [get_bd_pins mac_traffic_control_0/rst_n] \
  [get_bd_pins mac_flow_control_0/s00_axi_aresetn]
connect_bd_net -net s_axis_aclk_0_1 [get_bd_pins s_axis_aclk_0] \
  [get_bd_pins axis_interconnect_0/S00_AXIS_ACLK] [get_bd_pins axis_interconnect_0/ACLK] \
  [get_bd_pins axis_data_fifo_1/s_axis_aclk] [get_bd_pins mac_traffic_control_0/clk] \
  [get_bd_pins mac_flow_control_0/s00_axi_aclk] [get_bd_pins mac_flow_control_0/m00_axi_aclk]
connect_bd_net [get_bd_pins port0_mode] [get_bd_pins mode_selection_MAC0/mode_select_i]

current_bd_instance /
connect_bd_intf_net [get_bd_intf_ports M01_AXIS] [get_bd_intf_pins dfx_decoupler_2/rp_intf_1]
connect_bd_intf_net [get_bd_intf_pins axi_interconnect_1/M06_AXI] [get_bd_intf_pins axi_gpio_3/S_AXI]
connect_bd_intf_net [get_bd_intf_pins from_MAC01_is_MAC2/m1_axis] [get_bd_intf_pins MCDI/S00_AXIS]
connect_bd_intf_net [get_bd_intf_pins from_MAC10_is_MAC1/m1_axis] [get_bd_intf_pins dfx_decoupler_0/rp_intf_1]
connect_bd_intf_net [get_bd_intf_ports rx_AXIS_10] [get_bd_intf_pins from_MAC10_is_MAC1/S_AXIS_00]
connect_bd_intf_net [get_bd_intf_pins axi_interconnect_1/M04_AXI] [get_bd_intf_pins axi_gpio_1/S_AXI]
connect_bd_intf_net [get_bd_intf_ports M_AXIS_packetizer] [get_bd_intf_pins dfx_decoupler_3/rp_intf_2]
connect_bd_intf_net [get_bd_intf_pins MCDI/m1_axis] [get_bd_intf_pins dfx_decoupler_0/rp_intf_2]
connect_bd_intf_net [get_bd_intf_pins MCDI/m0_axis_MCDI] [get_bd_intf_pins axis_interconnect_0/S00_AXIS]
connect_bd_intf_net [get_bd_intf_pins axi_interconnect_1/M01_AXI] [get_bd_intf_pins version_register_0/s00_axi]
connect_bd_intf_net [get_bd_intf_ports S_AXIS_Lite] [get_bd_intf_pins dfx_decoupler_1/s_intf_0]
connect_bd_intf_net [get_bd_intf_ports M00_AXIS] [get_bd_intf_pins dfx_decoupler_2/rp_intf_0]
connect_bd_intf_net [get_bd_intf_pins dfx_decoupler_3/s_intf_2] [get_bd_intf_pins axis_interconnect_0/S01_AXIS]
connect_bd_intf_net [get_bd_intf_pins PS/M_AXIS_MM2S] [get_bd_intf_pins from_ps/S_AXIS]
connect_bd_intf_net [get_bd_intf_pins PS/M_AXI_HPM0_LPD] [get_bd_intf_pins axi_interconnect_1/S00_AXI]
connect_bd_intf_net [get_bd_intf_pins axi_interconnect_1/M00_AXI] [get_bd_intf_pins PS/S_AXI_LITE]
connect_bd_intf_net [get_bd_intf_pins axi_interconnect_1/M05_AXI] [get_bd_intf_pins axi_gpio_2/S_AXI]
connect_bd_intf_net [get_bd_intf_pins from_MAC11_is_MAC3/m0_axis] [get_bd_intf_pins to_MAC10_is_MAC1/S01_AXIS]
connect_bd_intf_net [get_bd_intf_pins axi_interconnect_1/M02_AXI] [get_bd_intf_pins dfx_decoupler_1/rp_intf_0]
connect_bd_intf_net [get_bd_intf_pins dfx_decoupler_2/s_intf_1] [get_bd_intf_pins to_MAC10_is_MAC1/S00_AXIS]
connect_bd_intf_net [get_bd_intf_pins dfx_decoupler_2/s_intf_0] [get_bd_intf_pins to_MAC00_is_MAC0/S00_AXIS]
connect_bd_intf_net [get_bd_intf_ports S_AXIS_MAC1] [get_bd_intf_pins dfx_decoupler_0/s_intf_1]
connect_bd_intf_net [get_bd_intf_pins dfx_decoupler_0/rp_intf_0] [get_bd_intf_pins from_MAC00_is_MAC0/m1_axis]
connect_bd_intf_net [get_bd_intf_pins dfx_decoupler_3/s_intf_1] [get_bd_intf_pins to_MAC11_is_MAC3/S01_AXIS]
connect_bd_intf_net [get_bd_intf_pins from_ps/M_AXIS1] [get_bd_intf_pins to_MAC01_is_MAC2/S00_AXIS]
connect_bd_intf_net [get_bd_intf_pins dfx_decoupler_3/s_intf_0] [get_bd_intf_pins to_MAC01_is_MAC2/S01_AXIS]
connect_bd_intf_net [get_bd_intf_pins from_ps/M_AXIS] [get_bd_intf_pins to_MAC11_is_MAC3/S00_AXIS]
connect_bd_intf_net [get_bd_intf_ports M03_AXIS] [get_bd_intf_pins dfx_decoupler_3/rp_intf_1]
connect_bd_intf_net [get_bd_intf_pins from_MAC00_is_MAC0/m0_axis] [get_bd_intf_pins to_MAC01_is_MAC2/S02_AXIS]
connect_bd_intf_net [get_bd_intf_ports S_AXIS_MAC0] [get_bd_intf_pins dfx_decoupler_0/s_intf_0]
connect_bd_intf_net [get_bd_intf_pins from_MAC10_is_MAC1/m0_axis] [get_bd_intf_pins to_MAC11_is_MAC3/S02_AXIS]
connect_bd_intf_net [get_bd_intf_ports rx_AXIS_01] [get_bd_intf_pins from_MAC01_is_MAC2/S_AXIS_00]
connect_bd_intf_net [get_bd_intf_ports rx_AXIS_00] [get_bd_intf_pins from_MAC00_is_MAC0/S_AXIS_00]
connect_bd_intf_net [get_bd_intf_ports M02_AXIS] [get_bd_intf_pins dfx_decoupler_3/rp_intf_0]
connect_bd_intf_net [get_bd_intf_pins axis_interconnect_0/M00_AXIS] [get_bd_intf_pins PS/S_AXIS]
connect_bd_intf_net [get_bd_intf_pins from_MAC01_is_MAC2/m0_axis] [get_bd_intf_pins to_MAC00_is_MAC0/S01_AXIS]
connect_bd_intf_net [get_bd_intf_ports tx_AXIS_11] [get_bd_intf_pins to_MAC11_is_MAC3/m_axis_01]
connect_bd_intf_net [get_bd_intf_ports rx_AXIS_11] [get_bd_intf_pins from_MAC11_is_MAC3/S_AXIS_00]
connect_bd_intf_net [get_bd_intf_ports tx_AXIS_01] [get_bd_intf_pins to_MAC01_is_MAC2/m_axis_01]
connect_bd_intf_net [get_bd_intf_pins from_MAC11_is_MAC3/m1_axis] [get_bd_intf_pins MCDI/S01_AXIS]
connect_bd_intf_net [get_bd_intf_pins axi_interconnect_1/M03_AXI] [get_bd_intf_pins axi_gpio_0/S_AXI]
connect_bd_intf_net [get_bd_intf_ports tx_AXIS_00] [get_bd_intf_pins to_MAC00_is_MAC0/m_axis_01]
connect_bd_intf_net [get_bd_intf_ports tx_AXIS_10] [get_bd_intf_pins to_MAC10_is_MAC1/m_axis_01]
connect_bd_intf_net [get_bd_intf_ports S_AXIS_MAC2_MAC3] [get_bd_intf_pins dfx_decoupler_0/s_intf_2]
connect_bd_net -net Din_01_0_1 [get_bd_ports stat_rx_pause_req_01_i] [get_bd_pins to_MAC01_is_MAC2/stat_rx_pause_req_01_i]
connect_bd_net -net Din_0_0_1 [get_bd_ports stat_rx_pause_req_00_i] [get_bd_pins to_MAC00_is_MAC0/stat_rx_pause_req_01_i]
connect_bd_net -net M00_AXIS_ACLK_0_0_1 [get_bd_ports tx_aclk_00] [get_bd_pins to_MAC00_is_MAC0/tx_clk_01]
connect_bd_net [get_bd_pins axi_gpio_0/gpio_io_o] [get_bd_pins dfx_decoupler_0/decouple]
connect_bd_net [get_bd_pins axi_gpio_1/gpio_io_o] [get_bd_pins dfx_decoupler_1/decouple]
connect_bd_net [get_bd_pins axi_gpio_2/gpio_io_o] [get_bd_pins dfx_decoupler_2/decouple]
connect_bd_net [get_bd_pins axi_gpio_3/gpio_io_o] [get_bd_pins dfx_decoupler_3/decouple]
connect_bd_net -net clk_in1_0_1 [get_bd_ports clk_100M_in] [get_bd_pins clk_wiz_0/clk_in1]
connect_bd_net [get_bd_pins clk_wiz_0/clk_200M] \
  [get_bd_ports clk_200M_out] [get_bd_pins to_MAC01_is_MAC2/usr_clk] [get_bd_pins PS/S00_AXIS_ACLK] \
  [get_bd_pins to_MAC11_is_MAC3/usr_clk] [get_bd_pins axi_interconnect_1/M01_ACLK] [get_bd_pins axi_interconnect_1/M02_ACLK] \
  [get_bd_pins axi_interconnect_1/M03_ACLK] [get_bd_pins axi_interconnect_1/M04_ACLK] \
  [get_bd_pins axi_interconnect_1/M05_ACLK] [get_bd_pins to_MAC10_is_MAC1/usr_clk] [get_bd_pins from_MAC00_is_MAC0/usr_clk] \
  [get_bd_pins to_MAC00_is_MAC0/usr_clk] [get_bd_pins from_ps/m1_axis_aclk] [get_bd_pins MCDI/clk_200M] \
  [get_bd_pins axis_interconnect_0/ACLK] [get_bd_pins axis_interconnect_0/S00_AXIS_ACLK] \
  [get_bd_pins axis_interconnect_0/M00_AXIS_ACLK] [get_bd_pins axis_interconnect_0/S01_AXIS_ACLK] \
  [get_bd_pins axi_gpio_2/s_axi_aclk] [get_bd_pins axi_gpio_1/s_axi_aclk] [get_bd_pins axi_gpio_0/s_axi_aclk] \
  [get_bd_pins axi_gpio_3/s_axi_aclk] [get_bd_pins axi_interconnect_1/M06_ACLK] [get_bd_pins from_MAC10_is_MAC1/usr_clk] \
  [get_bd_pins from_MAC01_is_MAC2/usr_clk] [get_bd_pins from_MAC11_is_MAC3/usr_clk] \
  [get_bd_pins version_register_0/s00_axi_aclk]
connect_bd_net [get_bd_pins clk_wiz_0/clk_400M] [get_bd_ports clk_400M_out]
connect_bd_net [get_bd_pins clk_wiz_0/locked] \
  [get_bd_ports resetn] [get_bd_pins to_MAC01_is_MAC2/user_aresetn] [get_bd_pins PS/s_axis_aresetn_0] \
  [get_bd_pins to_MAC11_is_MAC3/user_aresetn] [get_bd_pins axi_interconnect_1/M01_ARESETN] \
  [get_bd_pins axi_interconnect_1/M03_ARESETN] [get_bd_pins axi_interconnect_1/M02_ARESETN] \
  [get_bd_pins axi_interconnect_1/M05_ARESETN] [get_bd_pins axi_interconnect_1/M04_ARESETN] \
  [get_bd_pins to_MAC10_is_MAC1/user_aresetn] [get_bd_pins from_MAC00_is_MAC0/usr_resetn] \
  [get_bd_pins to_MAC00_is_MAC0/user_aresetn] [get_bd_pins from_ps/s_axis_aresetn] [get_bd_pins MCDI/s_axi_aresetn] \
  [get_bd_pins axis_interconnect_0/ARESETN] [get_bd_pins axis_interconnect_0/S00_AXIS_ARESETN] \
  [get_bd_pins axis_interconnect_0/M00_AXIS_ARESETN] [get_bd_pins axis_interconnect_0/S01_AXIS_ARESETN] \
  [get_bd_pins axi_gpio_2/s_axi_aresetn] [get_bd_pins axi_gpio_1/s_axi_aresetn] [get_bd_pins axi_gpio_0/s_axi_aresetn] \
  [get_bd_pins axi_gpio_3/s_axi_aresetn] [get_bd_pins axi_interconnect_1/M06_ARESETN] \
  [get_bd_pins from_MAC10_is_MAC1/usr_resetn] [get_bd_pins from_MAC01_is_MAC2/usr_resetn] \
  [get_bd_pins from_MAC11_is_MAC3/usr_resetn] [get_bd_pins version_register_0/s00_axi_aresetn]
connect_bd_net [get_bd_pins dfx_decoupler_0/decouple_status] [get_bd_pins axi_gpio_0/gpio2_io_i]
connect_bd_net [get_bd_pins dfx_decoupler_1/decouple_status] [get_bd_pins axi_gpio_1/gpio2_io_i]
connect_bd_net [get_bd_pins dfx_decoupler_2/decouple_status] [get_bd_pins axi_gpio_2/gpio2_io_i]
connect_bd_net [get_bd_pins dfx_decoupler_3/decouple_status] [get_bd_pins axi_gpio_3/gpio2_io_i]
connect_bd_net [get_bd_pins from_MAC00_is_MAC0/o_ctl_tx_pause_req_0] [get_bd_ports tx_pause_req_00_o]
connect_bd_net [get_bd_pins from_MAC00_is_MAC0/o_ctl_tx_resend_pause_0] [get_bd_ports tx_resend_pause_00_o]
connect_bd_net -net i_stat_tx_pause_valid_0_0_1 [get_bd_ports stat_tx_pause_valid_00_i] [get_bd_pins from_MAC00_is_MAC0/i_stat_tx_pause_valid_0]
connect_bd_net -net i_stat_tx_pause_valid_0_0_2 [get_bd_ports stat_tx_pause_valid_01_i] [get_bd_pins from_MAC01_is_MAC2/i_stat_tx_pause_valid_0]
connect_bd_net [get_bd_ports port0_mode] \
  [get_bd_pins MCDI/port0_mode] [get_bd_pins from_MAC00_is_MAC0/port0_mode] [get_bd_pins from_MAC01_is_MAC2/port0_mode]
connect_bd_net [get_bd_ports port1_mode] \
  [get_bd_pins MCDI/port1_mode] [get_bd_pins from_MAC10_is_MAC1/port0_mode] [get_bd_pins from_MAC11_is_MAC3/port0_mode]
connect_bd_net -net qdma_axi_aclk [get_bd_pins PS/pl_clk0] \
  [get_bd_pins axi_interconnect_1/ACLK] [get_bd_pins axi_interconnect_1/S00_ACLK] [get_bd_pins axi_interconnect_1/M00_ACLK] \
  [get_bd_pins from_ps/s_axis_aclk]
connect_bd_net -net qdma_axi_aresetn [get_bd_pins PS/peripheral_aresetn] \
  [get_bd_pins clk_wiz_0/resetn] [get_bd_pins axi_interconnect_1/ARESETN] [get_bd_pins axi_interconnect_1/S00_ARESETN] \
  [get_bd_pins axi_interconnect_1/M00_ARESETN]
connect_bd_net [get_bd_ports rx_aclk_01] [get_bd_pins from_MAC01_is_MAC2/s_axis_aclk_0]
connect_bd_net -net rx_aclk_10_1 [get_bd_ports rx_aclk_10] [get_bd_pins from_MAC10_is_MAC1/s_axis_aclk_0]
connect_bd_net -net rx_aclk_11_1 [get_bd_ports rx_aclk_11] [get_bd_pins from_MAC11_is_MAC3/s_axis_aclk_0]
connect_bd_net -net s_axis_aclk_0_0_1 [get_bd_ports rx_aclk_00] [get_bd_pins from_MAC00_is_MAC0/s_axis_aclk_0]
connect_bd_net -net s_axis_aresetn_0_0_1 [get_bd_ports s_axis_aresetn_0] \
  [get_bd_pins to_MAC01_is_MAC2/s_axis_aresetn] [get_bd_pins to_MAC11_is_MAC3/s_axis_aresetn] \
  [get_bd_pins to_MAC10_is_MAC1/s_axis_aresetn] [get_bd_pins from_MAC00_is_MAC0/s_axis_aresetn_0] \
  [get_bd_pins to_MAC00_is_MAC0/s_axis_aresetn] [get_bd_pins from_MAC10_is_MAC1/s_axis_aresetn_0] \
  [get_bd_pins from_MAC01_is_MAC2/s_axis_aresetn_0] [get_bd_pins from_MAC11_is_MAC3/s_axis_aresetn_0]
connect_bd_net [get_bd_ports stat_rx_pause_req_10_i] [get_bd_pins to_MAC10_is_MAC1/stat_rx_pause_req_01_i]
connect_bd_net [get_bd_ports stat_rx_pause_req_11_i] [get_bd_pins to_MAC11_is_MAC3/stat_rx_pause_req_11_i]
connect_bd_net [get_bd_ports stat_tx_pause_valid_10_i] [get_bd_pins from_MAC10_is_MAC1/i_stat_tx_pause_valid_0]
connect_bd_net [get_bd_ports stat_tx_pause_valid_11_i] [get_bd_pins from_MAC11_is_MAC3/i_stat_tx_pause_valid_0]
connect_bd_net -net tx_aclk_10_1 [get_bd_ports tx_aclk_10] [get_bd_pins to_MAC10_is_MAC1/tx_clk_01]
connect_bd_net -net tx_aclk_11_1 [get_bd_ports tx_aclk_11] [get_bd_pins to_MAC11_is_MAC3/tx_clk_11]
connect_bd_net -net tx_clk_01_0_1 [get_bd_ports tx_aclk_01] [get_bd_pins to_MAC01_is_MAC2/tx_clk_01]
connect_bd_net -net from_MAC00_is_MAC1_o_ctl_tx_pause_req_0 [get_bd_pins from_MAC10_is_MAC1/o_ctl_tx_pause_req_0] [get_bd_ports tx_pause_req_10_o]
connect_bd_net -net from_MAC00_is_MAC1_o_ctl_tx_resend_pause_0 [get_bd_pins from_MAC10_is_MAC1/o_ctl_tx_resend_pause_0] \
  [get_bd_ports tx_resend_pause_10_o]
connect_bd_net [get_bd_pins from_MAC01_is_MAC2/o_ctl_tx_pause_req_0] [get_bd_ports tx_pause_req_01_o]
connect_bd_net [get_bd_pins from_MAC01_is_MAC2/o_ctl_tx_resend_pause_0] [get_bd_ports tx_resend_pause_01_o]
connect_bd_net -net from_MAC01_is_MAC3_o_ctl_tx_pause_req_0 [get_bd_pins from_MAC11_is_MAC3/o_ctl_tx_pause_req_0] [get_bd_ports tx_pause_req_11_o]
connect_bd_net -net from_MAC01_is_MAC3_o_ctl_tx_resend_pause_0 [get_bd_pins from_MAC11_is_MAC3/o_ctl_tx_resend_pause_0] \
  [get_bd_ports tx_resend_pause_11_o]
connect_bd_net [get_bd_pins clk_wiz_0/clk_100M] [get_bd_ports clk_100M_out]

# ---- address map ----
assign_bd_address -offset 0x00000000 -range 2G -target_address_space [get_bd_addr_spaces PS/axi_mcdma_0/Data_MM2S] [get_bd_addr_segs PS/zynq_ultra_ps_e_0/SAXIGP2/HP0_DDR_LOW]
assign_bd_address -offset 0xC0000000 -range 512M -target_address_space [get_bd_addr_spaces PS/axi_mcdma_0/Data_MM2S] [get_bd_addr_segs PS/zynq_ultra_ps_e_0/SAXIGP2/HP0_QSPI]
assign_bd_address -offset 0xFF000000 -range 16M -target_address_space [get_bd_addr_spaces PS/axi_mcdma_0/Data_MM2S] [get_bd_addr_segs PS/zynq_ultra_ps_e_0/SAXIGP2/HP0_LPS_OCM]
exclude_bd_addr_seg -offset 0x00000000 -range 1 -target_address_space [get_bd_addr_spaces PS/axi_mcdma_0/Data_MM2S] [get_bd_addr_segs PS/zynq_ultra_ps_e_0/SAXIGP2/HP0_DDR_HIGH]
assign_bd_address -offset 0x00000000 -range 2G -target_address_space [get_bd_addr_spaces PS/axi_mcdma_0/Data_S2MM] [get_bd_addr_segs PS/zynq_ultra_ps_e_0/SAXIGP2/HP0_DDR_LOW]
assign_bd_address -offset 0xC0000000 -range 512M -target_address_space [get_bd_addr_spaces PS/axi_mcdma_0/Data_S2MM] [get_bd_addr_segs PS/zynq_ultra_ps_e_0/SAXIGP2/HP0_QSPI]
assign_bd_address -offset 0xFF000000 -range 16M -target_address_space [get_bd_addr_spaces PS/axi_mcdma_0/Data_S2MM] [get_bd_addr_segs PS/zynq_ultra_ps_e_0/SAXIGP2/HP0_LPS_OCM]
exclude_bd_addr_seg -offset 0x00000000 -range 1 -target_address_space [get_bd_addr_spaces PS/axi_mcdma_0/Data_S2MM] [get_bd_addr_segs PS/zynq_ultra_ps_e_0/SAXIGP2/HP0_DDR_HIGH]
assign_bd_address -offset 0x00000000 -range 2G -target_address_space [get_bd_addr_spaces PS/axi_mcdma_0/Data_SG] [get_bd_addr_segs PS/zynq_ultra_ps_e_0/SAXIGP2/HP0_DDR_LOW]
assign_bd_address -offset 0xC0000000 -range 512M -target_address_space [get_bd_addr_spaces PS/axi_mcdma_0/Data_SG] [get_bd_addr_segs PS/zynq_ultra_ps_e_0/SAXIGP2/HP0_QSPI]
exclude_bd_addr_seg -offset 0x00000000 -range 1 -target_address_space [get_bd_addr_spaces PS/axi_mcdma_0/Data_SG] [get_bd_addr_segs PS/zynq_ultra_ps_e_0/SAXIGP2/HP0_DDR_HIGH]
exclude_bd_addr_seg -offset 0xFF000000 -range 16M -target_address_space [get_bd_addr_spaces PS/axi_mcdma_0/Data_SG] [get_bd_addr_segs PS/zynq_ultra_ps_e_0/SAXIGP2/HP0_LPS_OCM]
assign_bd_address -offset 0x0080000000 -range 1M -target_address_space [get_bd_addr_spaces PS/zynq_ultra_ps_e_0/Data] [get_bd_addr_segs S_AXIS_Lite/Reg]
assign_bd_address -offset 0x0080100000 -range 64K -target_address_space [get_bd_addr_spaces PS/zynq_ultra_ps_e_0/Data] [get_bd_addr_segs version_register_0/s00_axi/reg0]
assign_bd_address -offset 0x0080200000 -range 64K -target_address_space [get_bd_addr_spaces PS/zynq_ultra_ps_e_0/Data] [get_bd_addr_segs PS/axi_mcdma_0/S_AXI_LITE/Reg]
assign_bd_address -offset 0x0080210000 -range 64K -target_address_space [get_bd_addr_spaces PS/zynq_ultra_ps_e_0/Data] [get_bd_addr_segs axi_gpio_0/S_AXI/Reg]
assign_bd_address -offset 0x0080220000 -range 64K -target_address_space [get_bd_addr_spaces PS/zynq_ultra_ps_e_0/Data] [get_bd_addr_segs axi_gpio_1/S_AXI/Reg]
assign_bd_address -offset 0x0080230000 -range 64K -target_address_space [get_bd_addr_spaces PS/zynq_ultra_ps_e_0/Data] [get_bd_addr_segs axi_gpio_2/S_AXI/Reg]
assign_bd_address -offset 0x0080240000 -range 64K -target_address_space [get_bd_addr_spaces PS/zynq_ultra_ps_e_0/Data] [get_bd_addr_segs axi_gpio_3/S_AXI/Reg]
